# Altium schematic sheet MEMS&RF.SchDoc
size A4
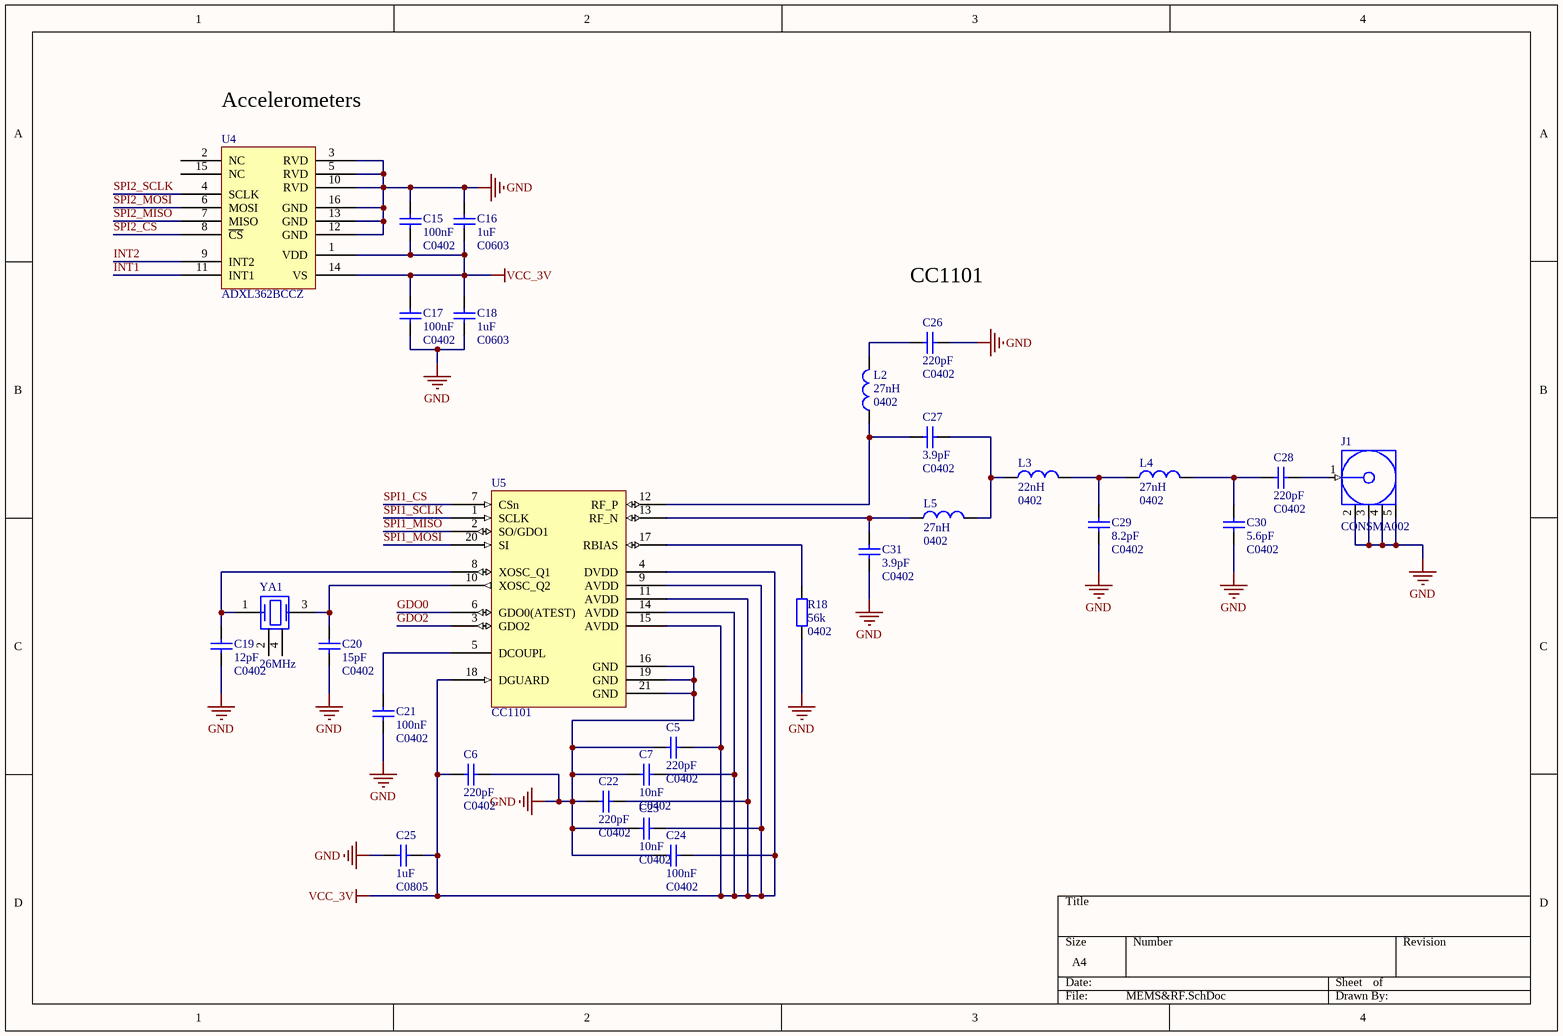
[diagram p0: MEMS&RF.SchDoc]

## Parts
C5  220pF  PackageReference: C0402  [0402]
C6  220pF  PackageReference: C0402  [0402]
C7  10nF  PackageReference: C0402  [0402]
C15  100nF  PackageReference: C0402  [0402]
C16  1uF  PackageReference: C0603  [1608[0603]]
C17  100nF  PackageReference: C0402  [0402]
C18  1uF  PackageReference: C0603  [1608[0603]]
C19  12pF  PackageReference: C0402  [0402]
C20  15pF  PackageReference: C0402  [0402]
C21  100nF  PackageReference: C0402  [0402]
C22  220pF  PackageReference: C0402  [0402]
C23  10nF  PackageReference: C0402  [0402]
C24  100nF  PackageReference: C0402  [0402]
C25  1uF  [C0805]
C26  220pF  PackageReference: C0402  [0402]
C27  3.9pF  PackageReference: C0402  [0402]
C28  220pF  PackageReference: C0402  [0402]
C29  8.2pF  PackageReference: C0402  [0402]
C30  5.6pF  PackageReference: C0402  [0402]
C31  3.9pF  PackageReference: C0402  [0402]
J1  CONSMA002  [CON-SMA-RA]
L2  27nH  [0402]
L3  22nH  [0402]
L4  27nH  [0402]
L5  27nH  [0402]
R18  56k  PackageReference: 0402  [RESC1005X04N]
U4  ADXL362BCCZ  [LGA_CC-16-4]
U5  CC1101  [QFN50P400X400X100_HS-21N]
YA1  26MHz  [XTAL-SMT-4P]

## Nets
GND: C5.2 C6.1 C7.1 C15.1 C16.2 C17.2 C18.1 C19.1 C20.1 C21.1 C22.2 C23.1 C24.2 C25.1 C26.2 C29.1 C30.1 C31.1 J1.2(GND) J1.3(GND) J1.4(GND) J1.5(GND) R18.1 U4.3(RVD) U4.5(RVD) U4.10(RVD) U4.12(GND) U4.13(GND) U4.16(GND) U5.16(GND) U5.19(GND) U5.21(GND)
VCC_3V: C5.1 C6.2 C7.2 C15.2 C16.1 C17.1 C18.2 C22.1 C23.2 C24.1 C25.2 U4.1(VDD) U4.14(VS) U5.4(DVDD) U5.9(AVDD) U5.11(AVDD) U5.14(AVDD) U5.15(AVDD) U5.18(DGUARD)
GDO0: U5.6(GDO0(ATEST))
GDO2: U5.3(GDO2)
INT1: U4.11(INT1)
INT2: U4.9(INT2)
SPI1_CS: U5.7(CSn)
SPI1_MISO: U5.2(SO/GDO1)
SPI1_MOSI: U5.20(SI)
SPI1_SCLK: U5.1(SCLK)
SPI2_CS: U4.8(~{CS})
SPI2_MISO: U4.7(MISO)
SPI2_MOSI: U4.6(MOSI)
SPI2_SCLK: U4.4(SCLK)
NetC19_2: C19.2 U5.8(XOSC_Q1) YA1.1
NetC20_2: C20.2 U5.10(XOSC_Q2) YA1.3
NetC21_2: C21.2 U5.5(DCOUPL)
NetC26_1: C26.1 L2.2
NetC27_1: C27.1 L2.1 U5.12(RF_P)
NetC27_2: C27.2 L3.1 L5.2
NetC28_1: C28.1 C30.2 L4.2
NetC28_2: C28.2 J1.1(Signal)
NetC29_2: C29.2 L3.2 L4.1
NetC31_2: C31.2 L5.1 U5.13(RF_N)
NetR18_2: R18.2 U5.17(RBIAS)

Not connected (* = marked no-connect by the designer): U4 2(NC) 15(NC); YA1 2 4

## Notes on the sheet
- (near U4) Accelerometers
- CC1101

## Library data of the parts
C5 C6 C22 C26 C28 = GRM1555C1H221JA01D: Capacitor (0402,NP0,220pF,DC 50V,±5%) Murata; Published: 8-Jun-2000; LatestRevisionDate: 29-May-2009; LatestRevisionNote: IPC-7351 Footprint Added.; Publisher: Altium Limited; PackageDescription: Chip Capacitor; Value: 220pF
C7 C23 = GRM155R71E103KA01D: Capacitor (0402,X7R,10nF,DC 25V,±10%) Murata; Published: 8-Jun-2000; LatestRevisionDate: 29-May-2009; LatestRevisionNote: IPC-7351 Footprint Added.; Publisher: Altium Limited; PackageDescription: Chip Capacitor; Value: 10nF
C15 C17 = C1005X7R1H104K050BE: Capacitor (0402,X7R,100nF,DC 50V,±10%) TDK; Published: 8-Jun-2000; LatestRevisionDate: 29-May-2009; LatestRevisionNote: IPC-7351 Footprint Added.; Publisher: Altium Limited; PackageDescription: Chip Capacitor; Value: 100nF
C16 C18 = CGA3E2X5R1A105K080AA: Capacitor (0603,X5R,1uF,DC 10V,+/-10%) TDK; Published: 8-Jun-2000; LatestRevisionDate: 29-May-2009; LatestRevisionNote: IPC-7351 Footprint Added.; Publisher: Altium Limited; PackageDescription: Chip Capacitor; Value: 1uF
C19 = GRM1555C1H120JZ01D: Capacitor (0402,NP0,12pF,DC 50V,±5%) Murata; Published: 8-Jun-2000; LatestRevisionDate: 29-May-2009; LatestRevisionNote: IPC-7351 Footprint Added.; Publisher: Altium Limited; PackageDescription: Chip Capacitor; Value: 12pF
C20 = GRM1555C1H150JZ01D: Capacitor (0402,NP0,15pF,DC 50V,±5%) Murata; Published: 8-Jun-2000; LatestRevisionDate: 29-May-2009; LatestRevisionNote: IPC-7351 Footprint Added.; Publisher: Altium Limited; PackageDescription: Chip Capacitor; Value: 15pF
C21 C24 = GRM155R71A104KA01D: Capacitor (0402,X5R,100nF,DC 10V,±10%) Murata; Published: 8-Jun-2000; LatestRevisionDate: 29-May-2009; LatestRevisionNote: IPC-7351 Footprint Added.; Publisher: Altium Limited; PackageDescription: Chip Capacitor; Value: 100nF
C25 = GRM21BR71C105KA01L: Capacitor (0805,X7R,1uF,DC 16V,±10%) Murata; Published: 8-Jun-2000; LatestRevisionDate: 29-May-2009; LatestRevisionNote: IPC-7351 Footprint Added.; Publisher: Altium Limited; PackageDescription: Chip Capacitor; Value: 1uF; PackageReference: C0805
C27 C31 = GRM1555C1H3R9CZ01D: Capacitor (0402,NP0,3.9pF,DC 50V,±0.25pF) Murata; Published: 8-Jun-2000; LatestRevisionDate: 29-May-2009; LatestRevisionNote: IPC-7351 Footprint Added.; Publisher: Altium Limited; PackageDescription: Chip Capacitor; Value: 3.9pF
C29 = GRM1555C1H8R2CZ01D: Capacitor (0402,NP0,8.2pF,DC 50V,±0.25pF) Murata; Published: 8-Jun-2000; LatestRevisionDate: 29-May-2009; LatestRevisionNote: IPC-7351 Footprint Added.; Publisher: Altium Limited; PackageDescription: Chip Capacitor; Value: 8.2pF
C30 = GRM1555C1H5R6CZ01D: Capacitor (0402,NP0,5.6pF,DC 50V,±0.25pF) Murata; Published: 8-Jun-2000; LatestRevisionDate: 29-May-2009; LatestRevisionNote: IPC-7351 Footprint Added.; Publisher: Altium Limited; PackageDescription: Chip Capacitor; Value: 5.6pF
J1 = CONSMA002: SMA Female Right Angle PCB Mount Connector; DatasheetVersion: rev1.2, Aug-2008; PackageVersion: rev1.2, Aug-2008; PackageReference: CON-SMA-RA; PackageDescription: SMA Female Right Angle, PCB Mount Connector, Thru-Hole, 7 x 7 mm Body; ComponentLink1Description: Manufacturer URL; ComponentLink1URL: http://www.linxtechnologies.com/; ComponentLink2Description: Datasheet; ComponentLink2URL: http://www.connectorcity.com/diagrams/SMA/CONSMA002.pdf
L2 L4 L5 = LQG15HS27NJ02D: Inductor, 27n, 0402, ±5% / Murata; Published: 8-Jun-2000; LatestRevisionDate: 29-May-2009; LatestRevisionNote: IPC-7351 Footprint Added.; Publisher: Altium Limited; PackageDescription: Inductor; Value: 27nH; PackageReference: 0402
L3 = LQG15HS22NJ02D: Inductor, 22n, 0402, ±5% / Murata; Published: 8-Jun-2000; LatestRevisionDate: 29-May-2009; LatestRevisionNote: IPC-7351 Footprint Added.; Publisher: Altium Limited; PackageDescription: Inductor; Value: 22nH; PackageReference: 0402
R18 = RK73H1ETTP5602F: Resistor, 56k ohms, 0402, ±1% Koa; PackageDescription: Chip Resistor, 2-Leads, Body 1.00x0.50mm, IPC Medium Density; Value: 56k
U4 = ADXL362BCCZ: ADXL362, LGA, CC-16-4.
U5 = CC1101: Low-Power Sub-1GHz RF Transceiver
YA1 = NX3225GA-26M: Crystal, 26.000000MHz, 10.0pF, 50 ohms max, 20/40 ppm, -40C to +85C / , NDK; Valid: 26MHz